# EAGLE design pcm2707_test_v0001 (EAGLE 6.4)
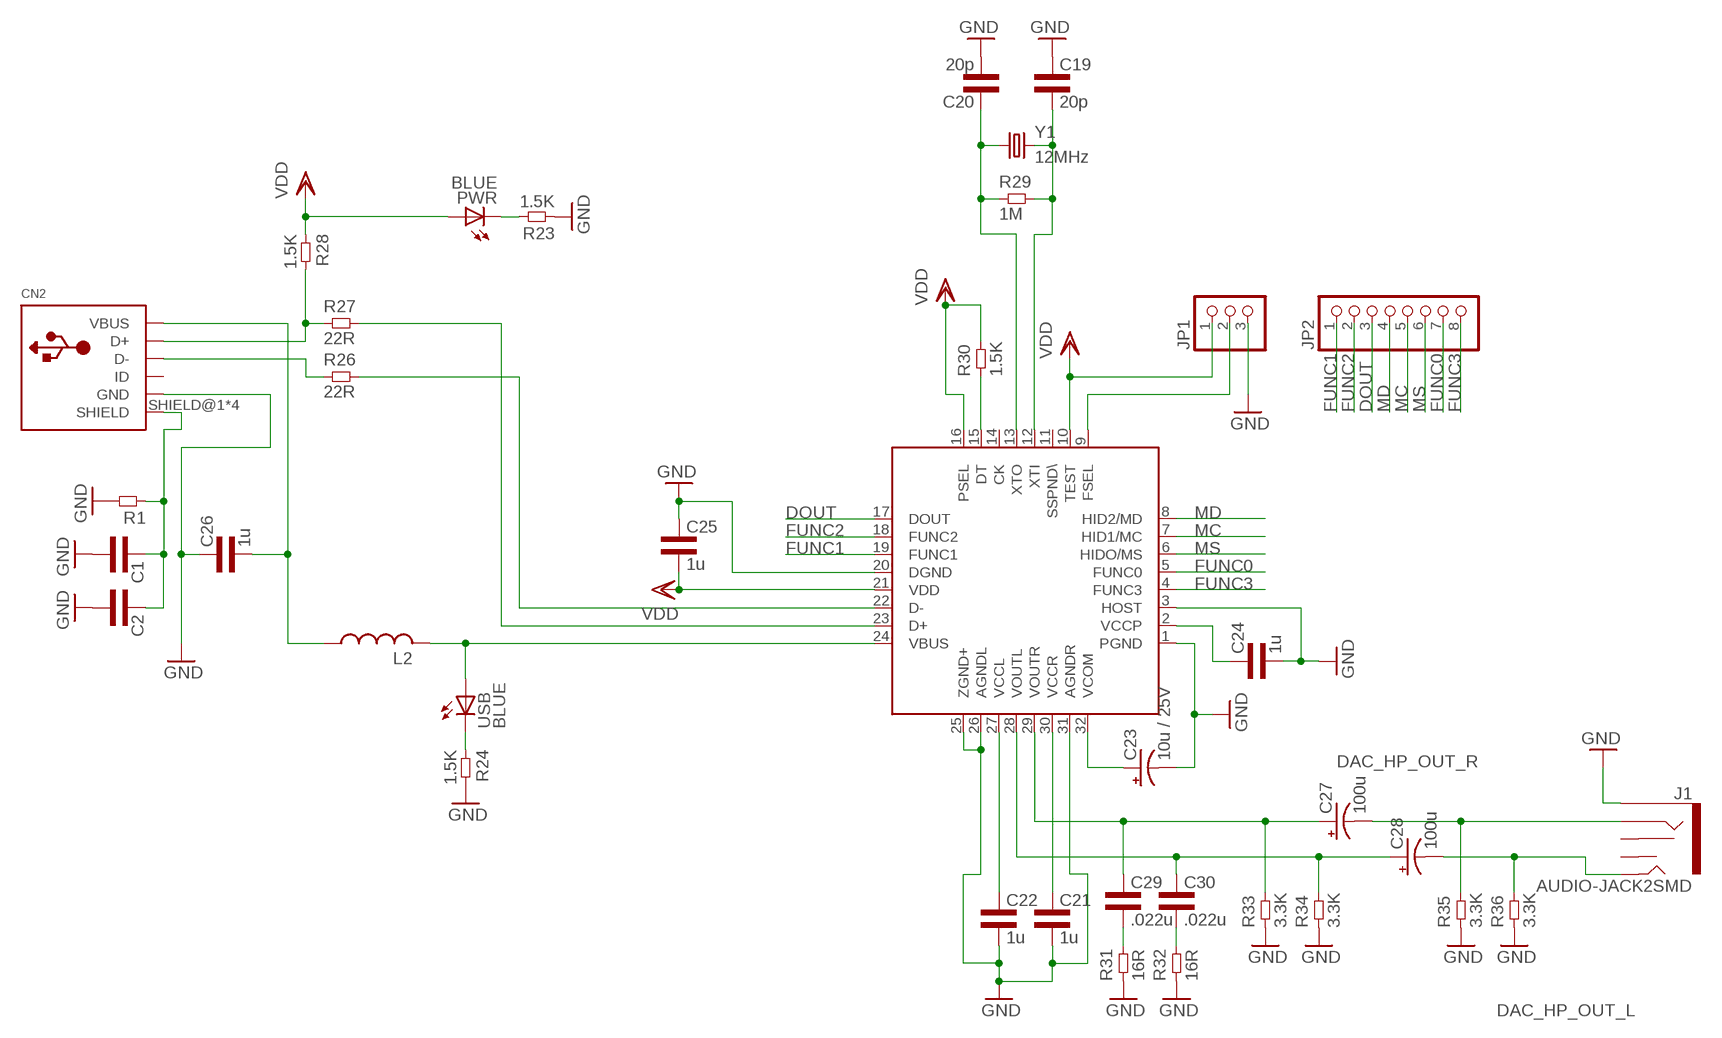
[diagram p0: schematic, sheet 1]

## Parts
C1  CAP0603L3  [0603L3]
C2  CAP0603L3  [0603L3]
C19  20p  CAP0603L3  [0603L3]
C20  20p  CAP0603L3  [0603L3]
C21  1u  CAP0603L3  [0603L3]
C22  1u  CAP0603L3  [0603L3]
C23  10u / 25V  CPOL-USE1.8-4  [E1,8-4]
C24  1u  CAP0603L3  [0603L3]
C25  1u  CAP0603L3  [0603L3]
C26  1u  CAP0603L3  [0603L3]
C27  100u  CPOL-USE2-5  [E2-5]
C28  100u  CPOL-USE2-5  [E2-5]
C29  .022u  CAP0603L3  [0603L3]
C30  .022u  CAP0603L3  [0603L3]
CN2  USBMINIB  [USB-MINIB]
J1  AUDIO-JACK2SMD  [AUDIO-JACK-3.5MM-SMD]
JP1  PINHD-1X3  [1X03]
JP2  PINHD-1X8  [1X08]
L2  RCL_L-USL3225M  [RCL_L3225M]
PWR  BLUE  LED-BLUE0603  [LED-0603]
R1  RES0603L3  [0603L3]
R23  1.5K  RES0603L3  [0603L3]
R24  1.5K  RES0603L3  [0603L3]
R26  22R  RES0603L3  [0603L3]
R27  22R  RES0603L3  [0603L3]
R28  1.5K  RES0603L3  [0603L3]
R29  1M  RES0603L3  [0603L3]
R30  1.5K  RES0603L3  [0603L3]
R31  16R  RES0603L3  [0603L3]
R32  16R  RES0603L3  [0603L3]
R33  3.3K  RES0603L3  [0603L3]
R34  3.3K  RES0603L3  [0603L3]
R35  3.3K  RES0603L3  [0603L3]
R36  3.3K  RES0603L3  [0603L3]
U$1  PCM2707_V1_PCM2704C_PCM2707  [PCM2707_V1_PCM2704C_PCM2707]
USB  BLUE  LED-BLUE0603  [LED-0603]
Y1  12MHz  CRYSTALHC49US  [HC49US]

## Nets
DAC_HP_OUT_L: C28.- J1.TIP R36.P$2
DAC_HP_OUT_R: C27.- J1.RING R35.P$2
DOUT: JP2.3 U$1.17(DOUT)
FUNC0: JP2.7 U$1.5(FUNC0)
FUNC1: JP2.1 U$1.19(FUNC1)
FUNC2: JP2.2 U$1.18(FUNC2)
FUNC3: JP2.8 U$1.4(FUNC3)
GND: C1.P$2 C2.P$2 C19.P$1 C20.P$2 C21.P$2 C22.P$2 C23.- C24.P$2 C25.P$1 C26.P$1 CN2.GND J1.SLEEVE JP1.3 R1.P$2 R23.P$1 R24.P$2 R31.P$1 R32.P$1 R33.P$1 R34.P$1 R35.P$1 R36.P$1 U$1.1(PGND) U$1.3(HOST) U$1.20(DGND) U$1.25(ZGND+) U$1.26(AGNDL) U$1.31(AGNDR)
MC: JP2.5 U$1.7(HID1/MC)
MD: JP2.4 U$1.8(HID2/MD)
MS: JP2.6 U$1.6(HIDO/MS)
N$1: JP1.2 U$1.9(FSEL)
N$2: PWR.C R23.P$2
N$3: C1.P$1 C2.P$1 CN2.SHIELD@1(SHIELD) CN2.SHIELD@2(SHIELD) CN2.SHIELD@3(SHIELD) CN2.SHIELD@4(SHIELD) R1.P$1
N$6: R24.P$1 USB.C
N$18: CN2.D+ R27.P$1 R28.P$2
N$21: CN2.D- R26.P$1
N$37: R27.P$2 U$1.23(D+)
N$42: R26.P$2 U$1.22(D-)
N$43: C20.P$1 R29.P$1 U$1.13(XTO) Y1.1
N$44: C19.P$2 R29.P$2 U$1.12(XTI) Y1.2
N$45: C22.P$1 U$1.27(VCCL)
N$50: C21.P$1 U$1.30(VCCR)
N$51: C23.+ U$1.32(VCOM)
N$52: C29.P$2 R31.P$2
N$53: C24.P$1 U$1.2(VCCP)
N$54: C27.+ C29.P$1 R33.P$2 U$1.29(VOUTR)
N$57: C28.+ C30.P$1 R34.P$2 U$1.28(VOUTL)
N$58: R30.P$1 U$1.15(DT)
N$59: C30.P$2 R32.P$2
VBUS: L2.2 U$1.24(VBUS) USB.A
VBUS_RAW: C26.P$2 CN2.VBUS L2.1
VDD: C25.P$2 JP1.1 PWR.A R28.P$1 R30.P$2 U$1.10(TEST) U$1.16(PSEL) U$1.21(VDD)
Unconnected: CN2.ID J1.RSH J1.TSH U$1.11(SSPND\) U$1.14(CK)

## Library data of the parts
C1 C2 C19-C22 C24-C26 C29 C30 = common:CAP
C23 C27 C28 = rcl:CPOL-US: POLARIZED CAPACITOR, American symbol
CN2 = adafruit:USB: USB Connectors USBMINIB - Surface Mount Female Mini-B USB Connector 4UConnector: 06564 By microbuilder.eu Thru-hole RA Female Mini-B USB Connector 4UConnector: 18732 By ladyada.net
J1 = SparkFun-Connectors:AUDIO-JACK2: Stereo audio jack with bypass switches. Used on LilyPad MP3 board. Production SKU: CONN-10353; PROD_ID: CONN-10353
JP1 = pinhead:PINHD-1X3: PIN HEADER
JP2 = pinhead:PINHD-1X8: PIN HEADER
L2 = pcm2707_v1:RCL_L-US: INDUCTOR, American symbol
PWR USB = SparkFun-LED:LED-BLUE: Blue LEDs for production use Various blue LEDs stocked by SparkFun production 0603 - DIO-08575 Rebel - DIO-09553 1206 - DIO-09911; PROD_ID: DIO-08575
R1 R23 R24 R26-R36 = common:RES
U$1 = my_dac_amp:PCM2707_V1_PCM2704C_PCM2707: Upgraded version of the PCM2704. It allows connecting to a device with USB and transmitting that data to another DAC using I2S protocol. Also has other advanced features that allow control with SPI, external buttons, etc.
Y1 = SparkFun-FreqCtrl:CRYSTAL: Various standard crystals. Proven footprints. Spark Fun Electronics SKU : COM-00534

## Board
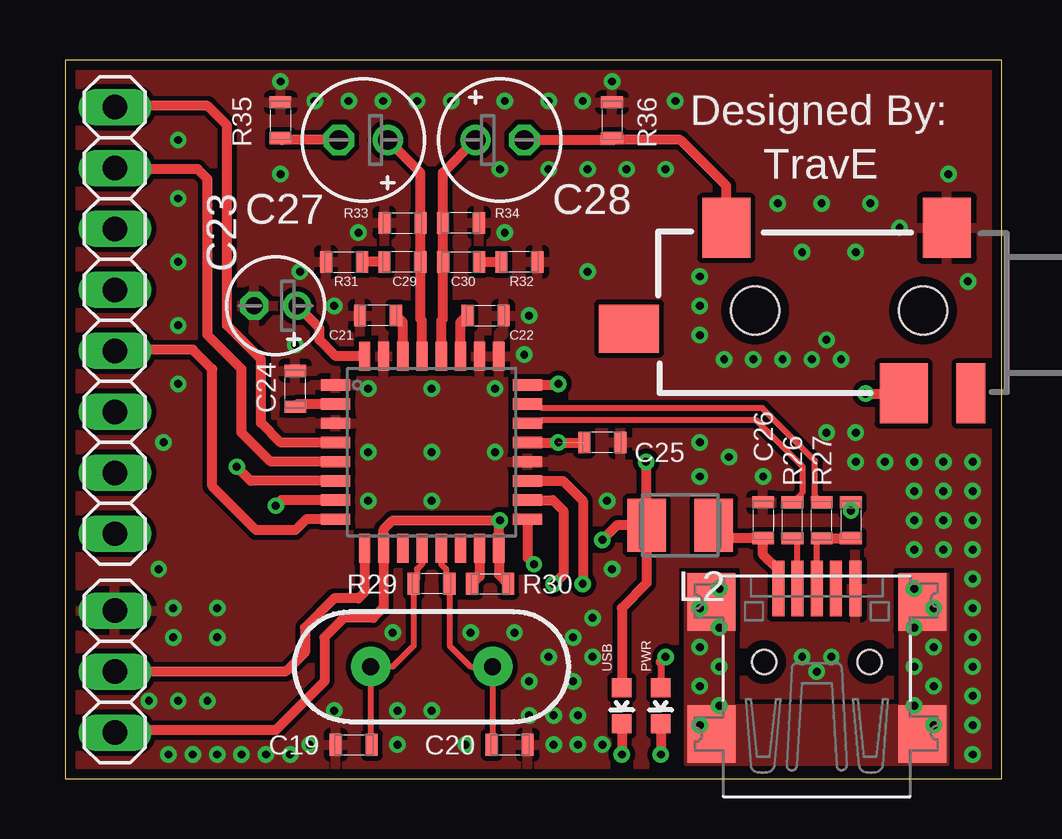
[diagram p1: board, top side]
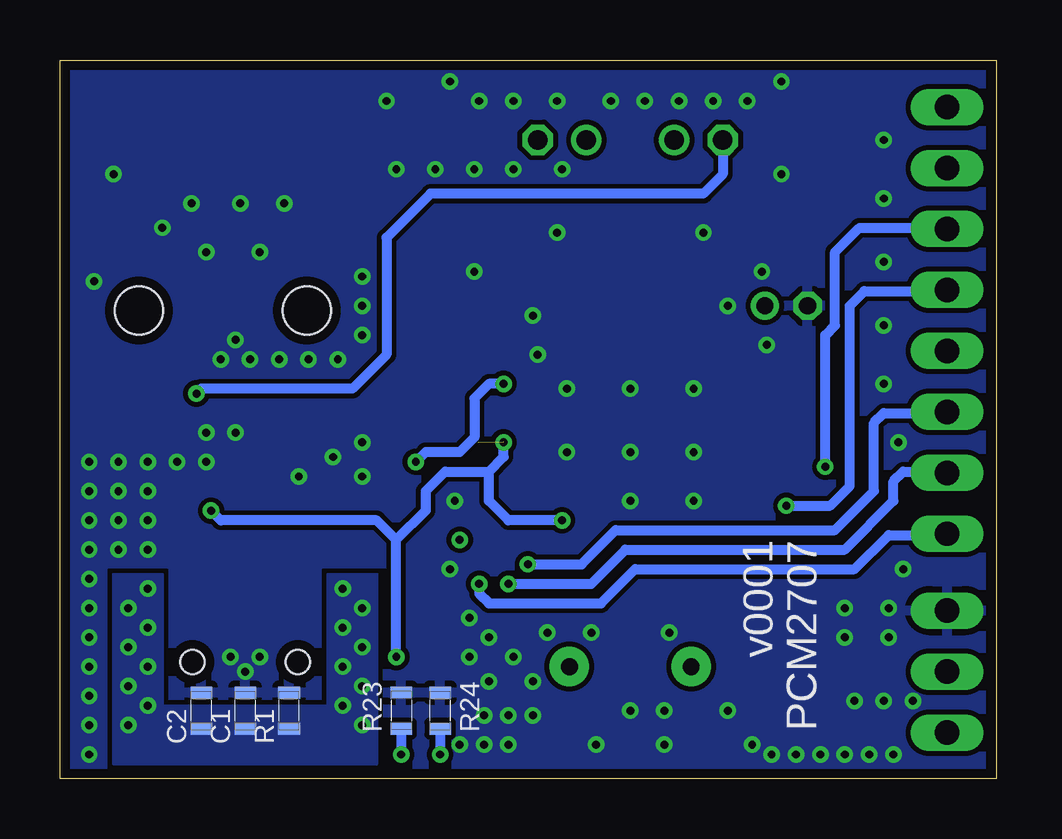
[diagram p2: board, bottom side, seen from below]

Size 39.04 x 29.95 mm. Coordinates in mm from the lower left corner, seen from the top.
Outline: 39.04,0 39.04,29.95 0,29.95 0,0 39.04,0
Copper layers (1*16): Top 0.035mm / dielectric 1.5mm / Bottom 0.035mm
Design rules "default *": minimum track width 8mil, minimum drill 13mil, track to track 8mil, track to pad 8mil, pad to pad 8mil, via to via 8mil, smd to smd 8mil, copper to edge 16mil, drill to drill 8mil, minimum pad ring 7mil, minimum via ring 7mil, stop-mask expansion 4mil, vias tented up to drill 18mil, thermal gap 10mil

### Footprints (pad centres in the part's own frame; a part is rotated, then mirrored left to right if it is on the bottom)
0603L3 = smd 0.5 x 0.9: P$1 -0.75,0; P$2 0.75,0
E1,8-4 = drill 0.711 pad 1.168: + -0.889,0 | drill 0.711 pad 1.168 octagon: - 0.889,0
E2-5 = drill 0.813 pad 1.27: + -1.016,0 | drill 0.813 pad 1.27 octagon: - 1.016,0
USB-MINIB = smd 0.5 x 2.308: D+ 0,4.064; D- -0.8,4.064; GND 1.6,4.064; ID 0.8,4.064; VBUS -1.6,4.064 | smd 2 x 2.4: SHIELD@1 -4.4,3.5; SHIELD@2 -4.4,-2; SHIELD@3 4.4,-2; SHIELD@4 4.4,3.5 | hole 1: -2.2,1; 2.2,1
AUDIO-JACK-3.5MM-SMD = smd 2 x 2.5: RING 4.3,3.45; SLEEVE 2.5,-3.45; TIP 11.7,-3.45 | smd 1.2 x 2.5: RSH 1.5,3.45 | smd 2.5 x 2: TSH 15.75,0.75 | hole 2: 3.5,0; 10.5,0
1X03 = drill 1.016 long: 1 -2.54,0; 2 0,0; 3 2.54,0
1X08 = drill 1.016 long: 1 -8.89,0; 2 -6.35,0; 3 -3.81,0; 4 -1.27,0; 5 1.27,0; 6 3.81,0; 7 6.35,0; 8 8.89,0
RCL_L3225M = smd 1.6 x 2.2: 1 -1.4,0; 2 1.4,0
LED-0603 = smd 0.8 x 0.8: A 0,-0.75; C 0,0.75
PCM2707_V1_PCM2704C_PCM2707 = smd 0.47 x 1.2: 1 -2.8,-4; 2 -2,-4; 3 -1.2,-4; 4 -0.4,-4; 5 0.4,-4; 6 1.2,-4; 7 2,-4; 8 2.8,-4; 17 2.8,4; 18 2,4; 19 1.2,4; 20 0.4,4; 21 -0.4,4; 22 -1.2,4; 23 -2,4; 24 -2.8,4 | smd 1.2 x 0.47: 9 4,-2.8; 10 4,-2; 11 4,-1.2; 12 4,-0.4; 13 4,0.4; 14 4,1.2; 15 4,2; 16 4,2.8; 25 -4,2.8; 26 -4,2; 27 -4,1.2; 28 -4,0.4; 29 -4,-0.4; 30 -4,-1.2; 31 -4,-2; 32 -4,-2.8
HC49US = drill 0.7 pad 1.651: 1 -2.54,0; 2 2.54,0

### Placement (x,y rotation side)
C1  31.32,2.84 90 bottom
C2  33.15,2.84 90 bottom
C19  12.01,1.42 0 top
C20  18.52,1.42 0 top
C21  13.03,19.3 180 top
C22  17.5,19.3 0 top
C23  8.76,19.71 180 top
C24  9.58,16.26 90 top
C25  22.38,14.02 180 top
C26  29.08,10.77 270 top
C27  12.42,26.62 180 top
C28  18.11,26.62 0 top
C29  14.05,21.54 180 top
C30  16.48,21.54 0 top
CN2  31.32,3.86 0 top
J1  39.24,19.51 180 top
JP1  2.06,4.47 90 top
JP2  2.06,19.1 90 top
L2  25.63,10.57 180 top
PWR  24.82,3.05 180 top
R1  29.49,2.84 90 bottom
R23  24.82,2.84 270 bottom
R24  23.19,2.84 90 bottom
R26  30.3,10.77 90 top
R27  31.52,10.77 90 top
R28  32.74,10.77 270 top
R29  15.27,8.13 180 top
R30  17.7,8.13 0 top
R31  11.61,21.54 0 top
R32  18.92,21.54 180 top
R33  14.05,23.16 0 top
R34  16.48,23.16 180 top
R35  8.97,27.43 270 top
R36  22.78,27.43 270 top
U$1  15.27,13.61 270 top
USB  23.19,3.05 180 top
Y1  15.27,4.67 180 top

### Tracks (layer width: path | path; a pad name or v marks a point on that pad's centre or on a via)
DAC_HP_OUT_L
  Top 0.406: C28.- 22.72,26.62 R36.P$2 22.85,26.62 25.63,26.62 27.54,24.7 J1.TIP
DAC_HP_OUT_R  (via drill 0.33)
  Top 0.406: v33.35,16.05 J1.RING | C27.- 9.03,26.62 R35.P$2
  Bottom 0.406: C27.- 11.4,25.2 12.22,24.38 23.6,24.38 25.43,22.56 25.43,17.68 26.85,16.26 33.15,16.26 v33.35,16.05
DOUT  (via drill 0.33)
  Top 0.406: U$1.17 19.27,9.21 v19.53,8.94
  Bottom 0.406: v19.53,8.94 17.3,8.94 15.88,10.36 6.73,10.36 5.11,11.99 5.11,14.83 4.7,15.24 2.11,15.24 JP2.3
FUNC0
  Top 0.406: U$1.5 8.55,13.21 7.34,14.43 7.34,17.07 5.92,18.49 5.92,24.99 5.51,25.4 2.11,25.4 JP2.7
FUNC1  (via drill 0.33)
  Top 0.406: U$1.19 20.73,12.41 21.56,11.58 v21.56,8.13
  Bottom 0.406: v21.56,8.13 21.56,7.72 21.16,7.31 16.48,7.31 15.06,8.74 5.92,8.74 4.5,10.16 2.11,10.16 JP2.1
FUNC2  (via drill 0.33)
  Top 0.406: U$1.18 20.31,11.61 20.75,11.18 20.75,8.53 v20.35,8.13
  Bottom 0.406: v20.35,8.13 16.89,8.13 15.47,9.55 6.32,9.55 4.29,11.58 4.29,12.4 3.89,12.8 2.11,12.8 JP2.2
FUNC3
  Top 0.406: U$1.4 8.97,14.01 8.15,14.83 8.15,17.48 6.73,18.9 6.73,27.23 5.92,28.04 2.11,28.04 JP2.8
GND  (via drill 0.33)
  other vias: 9.58,18.08 11.2,19.71 9.78,21.13 12.22,22.76 18.31,22.76 21.77,21.13 19.33,19.3 29.08,12.6 17.91,16.26 12.62,16.26 12.62,13.61 15.27,13.61 15.27,16.26 15.27,2.84 13.84,1.42 16.69,1.42 10.19,1.42 9.37,1.02 8.36,1.02 7.34,1.02 6.32,1.02 5.31,1.02 4.29,1.02 20.35,1.42 21.36,1.42 22.38,1.42 19.33,2.64 20.35,2.64 21.36,2.64 22.78,8.74 21.97,6.71 21.97,5.08 21.16,5.89 20.14,5.08 16.89,6.1 18.72,6.1 19.33,4.06 21.16,4.06 13.64,6.1 11.2,2.84 26.44,14.02 26.44,12.6 27.66,13.41 37.82,1.02 37.82,2.24 37.82,3.45 37.82,4.67 37.82,5.89 37.82,7.11 37.82,8.33 37.82,9.55 37.82,10.77 37.82,11.99 37.82,13.21 36.6,13.21 36.6,11.99 36.6,10.77 36.6,9.55 35.38,9.55 35.38,10.77 35.38,11.99 35.38,13.21 34.16,13.21 32.94,13.21 32.94,14.43 31.72,14.43 26.44,20.93 26.44,19.71 26.44,18.49 27.46,17.48 28.68,17.48 29.9,17.48 31.12,17.48 32.33,17.48 31.72,18.29 18.11,25.4 20.14,25.4 21.77,25.4 23.39,25.4 25.02,25.4 10.39,28.24 11.81,28.24 13.23,28.24 14.66,28.24 16.08,28.24 18.31,28.24 20.14,28.24 21.56,28.24 25.43,28.24 29.69,23.98 31.52,23.98 33.55,23.98 34.77,22.96 36.8,25.2 37.62,20.73 30.71,21.95 32.94,21.95 8.97,25.2 4.7,24.18 4.7,26.62 4.7,21.54 4.7,18.9 4.7,18.9 4.7,16.46 4.09,14.02 3.89,8.74 4.5,7.11 6.32,7.11 4.5,5.89 6.32,5.89 3.48,3.25 4.7,3.25 5.92,3.25 13.84,2.84 12.62,11.58 17.91,13.61 30.71,5.08 31.93,5.08 31.32,4.47 15.27,11.58 22.58,11.58 19.13,17.68 8.97,29.06 22.78,29.06
  pour Top (rank 6): 0.64,0.41 0.64,29.46 38.63,29.46 38.63,0.41
  pour Bottom (rank 6): 0.64,0.41 0.64,29.46 38.63,29.46 38.63,0.41
MC  (via drill 0.33)
  Top 0.406: U$1.7 9,11.61 v8.76,11.38
  Bottom 0.406: v8.76,11.38 6.93,11.38 6.12,12.19 6.12,19.71 5.51,20.32 2.11,20.32 JP2.5
MD
  Top 0.406: U$1.8 10.03,10.81 9.58,10.36 7.95,10.36 6.12,12.19 6.12,17.07 5.31,17.88 2.11,17.88 JP2.4
MS  (via drill 0.33)
  Top 0.406: U$1.6 7.73,12.41 v7.14,13.01
  Bottom 0.406: v7.14,13.01 7.14,18.49 6.73,18.9 6.73,21.95 5.72,22.96 2.11,22.96 JP2.6
N$1
  Top 0.406: U$1.9 12.47,7.77 12.22,7.52 11.2,7.52 9.98,6.3 9.98,5.28 9.17,4.47 JP1.2
N$2  (via drill 0.33)
  Top 0.406: PWR.C v24.82,1.02
  Bottom 0.406: R23.P$2 v24.82,1.02
N$3  (via drill 0.33)
  other vias: 27.25,7.92 26.44,7.11 27.25,6.3 26.44,5.49 27.25,4.67 26.44,3.86 26.44,2.24 27.25,3.05 35.38,7.92 36.2,7.11 35.38,6.3 35.38,4.67 36.2,5.49 36.2,3.86 35.38,3.05 36.2,2.24
  pour Top (no thermals): 25.83,8.53 25.83,0.61 36.8,0.61 36.8,8.53 34.77,8.53 34.77,3.05 27.86,3.05 27.86,8.53
  pour Bottom (no thermals): 25.83,8.53 25.83,0.61 36.8,0.61 36.8,8.53 34.77,8.53 34.77,3.05 27.86,3.05 27.86,8.53
N$6  (via drill 0.33)
  Top 0.406: USB.C v23.19,1.02
  Bottom 0.406: R24.P$1 v23.19,1.02
N$18
  Top 0.254: CN2.D+ 31.32,9.82 R27.P$1
  Top 0.406: R27.P$1 R28.P$2
N$21
  Top 0.254: CN2.D- 30.52,9.8 R26.P$1
N$37
  Top 0.254: U$1.23 19.31,15.57 19.74,15.57 19.86,15.44 29.06,15.44 31.24,13.26 31.24,11.8 R27.P$2
N$42
  Top 0.254: U$1.22 19.74,14.81 19.86,14.94 28.8,14.94 30.73,13.01 30.73,11.95 R26.P$2
N$43
  Top 0.254: U$1.13 15.67,8.95 15.88,8.74 15.88,8.27 R29.P$1 16.02,5.55 16.89,4.67 Y1.1 17.81,1.46 C20.P$1
N$44
  Top 0.254: U$1.12 14.87,8.95 14.66,8.74 14.66,8.27 R29.P$2 14.52,5.55 13.64,4.67 Y1.2 12.73,1.46 C19.P$2
N$45
  Top 0.406: U$1.27 16.47,19.02 C22.P$1
N$50
  Top 0.406: U$1.30 14.07,19.02 C21.P$1
N$51
  Top 0.406: U$1.32 11.27,17.61 10.59,18.29 10.59,18.77 C23.+
N$52
  Top 0.406: C29.P$2 R31.P$2
N$53
  Top 0.406: U$1.2 9.68,15.61 C24.P$1
N$54
  Top 0.406: U$1.29 14.86,19.1 14.8,19.16 C29.P$1 R33.P$2 14.8,25.26 C27.+
N$57
  Top 0.406: U$1.28 15.67,19.1 15.73,19.16 C30.P$1 R34.P$2 15.73,25.26 C28.+
N$58
  Top 0.406: U$1.15 17.27,8.44 R30.P$1
N$59
  Top 0.406: C30.P$2 R32.P$2
VBUS  (via drill 0.33)
  Top 0.406: L2.2 22.99,10.57 v22.38,9.96 | L2.2 24.23,8.15 23.19,7.11 USB.A | U$1.24 20.5,16.41 v20.55,16.46 | v24.21,13.21 24.21,10.59 L2.2
  Bottom 0.406: v20.55,16.46 21.16,16.46 21.77,15.85 21.77,14.22 22.38,13.61 23.8,13.61 v24.21,13.21
VBUS_RAW
  Top 0.406: CN2.VBUS 29.72,8.71 29.08,9.35 C26.P$2 27.58,10.02 L2.1
VDD  (via drill 0.33)  (1 unrouted)
  Top 0.292: 24.82,4.88 PWR.A
  Top 0.406: R30.P$2 18.07,8.52 U$1.16 18.07,10.73 v18.11,10.77 13.64,10.77 13.27,10.4 U$1.10 13.27,7.14 12.83,6.71 11.61,6.71 10.8,5.89 10.8,4.06 8.76,2.03 2.16,2.03 JP1.1 | 24.82,4.88 v25.02,5.08 | U$1.21 C25.P$2 | R28.P$1 v32.74,11.18
  Bottom 0.406: 21.16,12.8 22.99,12.8 23.8,11.99 23.8,11.18 25.02,9.96 | 21.16,12.8 20.55,13.41 v20.55,14.02 | v18.11,10.77 20.35,10.77 21.16,11.58 21.16,12.8 | v25.02,5.08 25.02,9.96 | 25.02,9.96 25.83,10.77 32.33,10.77 v32.74,11.18

### Text on the board
tPlace: Designed By: | TravE
bPlace: PCM2707 | v0001